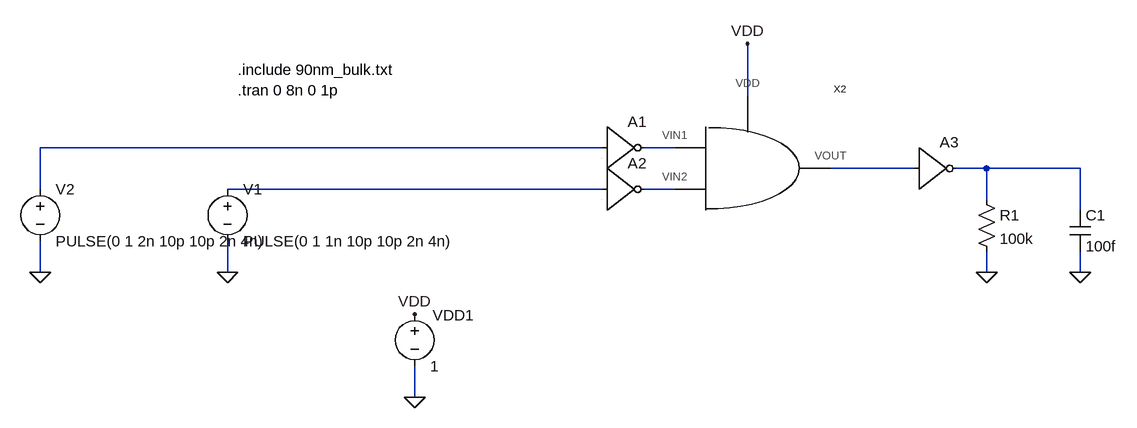
[diagram p0: schematic test.asc]
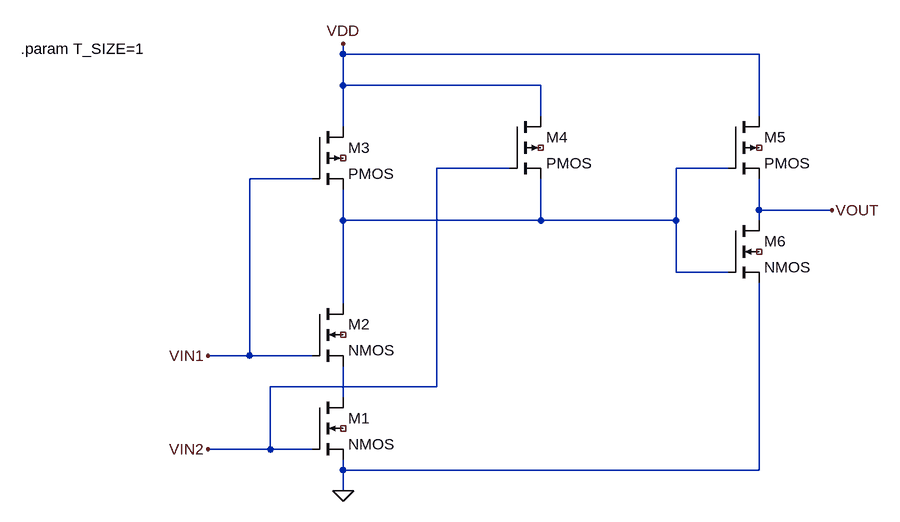
[diagram p1: sub-circuit and.asc]
test.asc, the LTspice schematic file:
Version 4
SHEET 1 1452 680
WIRE 880 -32 880 -112
WIRE 656 48 -208 48
WIRE 768 48 720 48
WIRE 1136 80 1008 80
WIRE 1248 80 1200 80
WIRE 1392 80 1248 80
WIRE -208 112 -208 48
WIRE 656 112 80 112
WIRE 768 112 720 112
WIRE 1248 128 1248 80
WIRE 1392 144 1392 80
WIRE -208 240 -208 192
WIRE 80 240 80 192
WIRE 1248 240 1248 208
WIRE 1392 240 1392 208
WIRE 368 432 368 384
FLAG 368 304 VDD
FLAG 368 432 0
FLAG 80 240 0
FLAG 1248 240 0
FLAG 1392 240 0
FLAG 880 -112 VDD
FLAG -208 240 0
SYMBOL voltage 80 96 R0
SYMATTR InstName V1
SYMATTR Value PULSE(0 1 1n 10p 10p 2n 4n)
SYMBOL voltage 368 288 R0
WINDOW 0 28 18 Left 2
SYMATTR InstName VDD1
SYMATTR Value 1
SYMBOL cap 1376 144 R0
SYMATTR InstName C1
SYMATTR Value 100f
SYMBOL res 1232 112 R0
SYMATTR InstName R1
SYMATTR Value 100k
SYMBOL and 816 80 R0
SYMATTR InstName X2
SYMBOL Digital\\inv 656 -16 R0
SYMATTR InstName A1
SYMBOL Digital\\inv 656 48 R0
SYMATTR InstName A2
SYMBOL Digital\\inv 1136 16 R0
SYMATTR InstName A3
SYMBOL voltage -208 96 R0
WINDOW 123 0 0 Left 2
WINDOW 39 0 0 Left 2
SYMATTR InstName V2
SYMATTR Value PULSE(0 1 2n 10p 10p 2n 4n)
TEXT 96 -40 Left 2 !.tran 0 8n 0 1p
TEXT 96 -72 Left 2 !.include 90nm_bulk.txt

and.asc, the sub-circuit schematic file:
Version 4
SHEET 1 1124 680
WIRE 288 -336 288 -352
WIRE 928 -336 288 -336
WIRE 288 -288 288 -336
WIRE 592 -288 288 -288
WIRE 592 -240 592 -288
WIRE 928 -240 928 -336
WIRE 288 -224 288 -288
WIRE 544 -160 432 -160
WIRE 880 -160 800 -160
WIRE 240 -144 144 -144
WIRE 928 -96 928 -144
WIRE 1040 -96 928 -96
WIRE 288 -80 288 -128
WIRE 592 -80 592 -144
WIRE 592 -80 288 -80
WIRE 800 -80 800 -160
WIRE 800 -80 592 -80
WIRE 928 -80 928 -96
WIRE 800 0 800 -80
WIRE 880 0 800 0
WIRE 288 48 288 -80
WIRE 144 128 144 -144
WIRE 144 128 80 128
WIRE 240 128 144 128
WIRE 432 176 432 -160
WIRE 432 176 176 176
WIRE 288 192 288 144
WIRE 176 272 176 176
WIRE 176 272 80 272
WIRE 240 272 176 272
WIRE 288 304 288 288
WIRE 928 304 928 16
WIRE 928 304 288 304
WIRE 288 336 288 304
FLAG 80 128 VIN1
FLAG 80 272 VIN2
FLAG 288 336 0
FLAG 1040 -96 VOUT
FLAG 288 -352 VDD
SYMBOL nmos4 240 192 R0
SYMATTR InstName M1
SYMATTR Value2 l=90n w='(T_SIZE)*200n'
SYMBOL nmos4 240 48 R0
SYMATTR InstName M2
SYMATTR Value2 l=90n w='(T_SIZE)*200n'
SYMBOL pmos4 240 -224 R0
SYMATTR InstName M3
SYMATTR Value2 l=90n w='(T_SIZE)*400n'
SYMBOL pmos4 544 -240 R0
SYMATTR InstName M4
SYMATTR Value2 l=90n w='(T_SIZE)*400n'
SYMBOL pmos4 880 -240 R0
SYMATTR InstName M5
SYMATTR Value2 l=90n w='(T_SIZE)*400n'
SYMBOL nmos4 880 -80 R0
SYMATTR InstName M6
SYMATTR Value2 l=90n w='(T_SIZE)*200n'
TEXT -208 -344 Left 2 !.param T_SIZE=1

The netlist it stands for:
* test.asc
V1 N005 0 PULSE(0 1 1n 10p 10p 2n 4n)
VDD1 VDD 0 1
C1 N004 0 100f
R1 N004 0 100k
XX2 N002 N006 VDD N003 and
A1 N001 0 0 0 0 N002 0 0 BUF
A2 N005 0 0 0 0 N006 0 0 BUF
A3 N003 0 0 0 0 N004 0 0 BUF
V2 N001 0 PULSE(0 1 2n 10p 10p 2n 4n)

* block symbol definitions
.subckt and VIN1 VIN2 VDD VOUT
M1 N002 VIN2 0 NC_01 NMOS l=90n w='(T_SIZE)*200n'
M2 N001 VIN1 N002 NC_02 NMOS l=90n w='(T_SIZE)*200n'
M3 VDD VIN1 N001 NC_03 PMOS l=90n w='(T_SIZE)*400n'
M4 VDD VIN2 N001 NC_04 PMOS l=90n w='(T_SIZE)*400n'
M5 VDD N001 VOUT NC_05 PMOS l=90n w='(T_SIZE)*400n'
M6 VOUT N001 0 NC_06 NMOS l=90n w='(T_SIZE)*200n'
.param T_SIZE=1
.ends and

.model NMOS NMOS
.model PMOS PMOS
.lib standard.mos
.tran 0 8n 0 1p
.include 90nm_bulk.txt
.backanno
.end